# Altium schematic sheet CONNECTOR.SchDoc
size A4; SheetNumber: 14; SheetTotal: 14
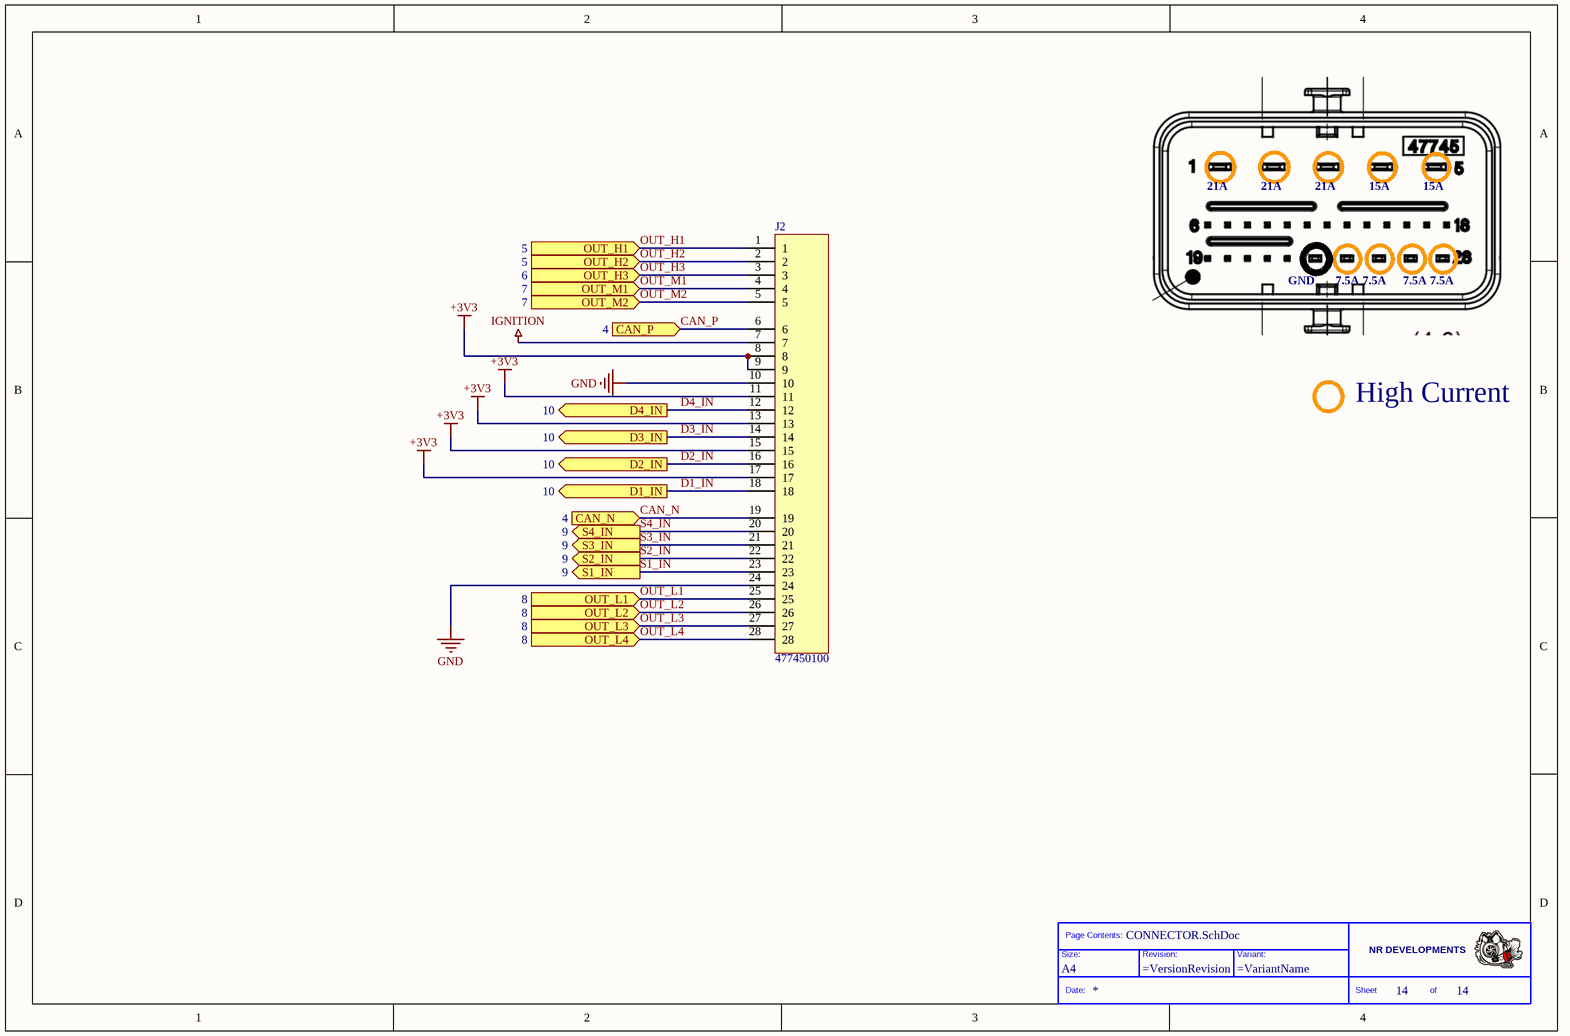
[diagram p0: CONNECTOR.SchDoc]

## Parts
*  Size: A4  (hidden comment: Title_Block)  (graphical)
J2  value 477450100  [MOLEX_0477450100]  (hidden comment: Connector)

## Ports
CAN_N (in, see 4), CAN_P (in, see 4), D1_IN (out, see 10), D2_IN (out, see 10), D3_IN (out, see 10), D4_IN (out, see 10), OUT_H1 (in, see 5), OUT_H2 (in, see 5), OUT_H3 (in, see 6), OUT_L1 (in, see 8), OUT_L2 (in, see 8), OUT_L3 (in, see 8), OUT_L4 (in, see 8), OUT_M1 (in, see 7), OUT_M2 (in, see 7), S1_IN (out, see 9), S2_IN (out, see 9), S3_IN (out, see 9), S4_IN (out, see 9)

## Nets
+3V3: J2.8 J2.9 J2.11 J2.13 J2.15 J2.17
GND: J2.10 J2.24
IGNITION: J2.7
CAN_N: J2.19 ; port CAN_N
CAN_P: J2.6 ; port CAN_P
D1_IN: J2.18 ; port D1_IN
D2_IN: J2.16 ; port D2_IN
D3_IN: J2.14 ; port D3_IN
D4_IN: J2.12 ; port D4_IN
OUT_H1: J2.1 ; port OUT_H1
OUT_H2: J2.2 ; port OUT_H2
OUT_H3: J2.3 ; port OUT_H3
OUT_L1: J2.25 ; port OUT_L1
OUT_L2: J2.26 ; port OUT_L2
OUT_L3: J2.27 ; port OUT_L3
OUT_L4: J2.28 ; port OUT_L4
OUT_M1: J2.4 ; port OUT_M1
OUT_M2: J2.5 ; port OUT_M2
S1_IN: J2.23 ; port S1_IN
S2_IN: J2.22 ; port S2_IN
S3_IN: J2.21 ; port S3_IN
S4_IN: J2.20 ; port S4_IN

## Notes on the sheet
- 21A
- 15A
- GND
- 7.5A
- High Current
- (in symbol Title_Block) Page Contents:; NR DEVELOPMENTS; Size:; Revision:; Variant:; Date:; Sheet; of

## Library data of the parts
J2 = MOLEX_477450100: Connector Header Board Edge, Through Hole, Right Angle 28 position; Manufacturer: Molex; PartNumber: 0477450100